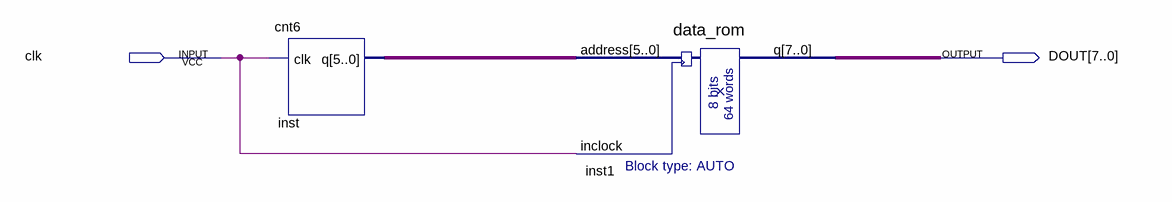
[diagram p0: schematic sheet]
// Quartus schematic singt.bdf as structural Verilog: 2 symbols, 2 pins
module singt (
  input  clk,
  output [7:0] DOUT
);

  wire [5:0] inst_q;

  cnt6 inst (.clk(clk), .q(inst_q));
  data_rom inst1 (.address(inst_q), .inclock(clk), .q(DOUT));
endmodule
